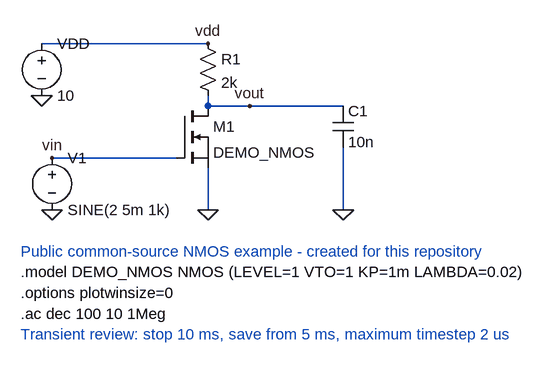
[diagram p0: schematic common_source_amplifier.asc]
common_source_amplifier.asc, the LTspice schematic file:
Version 4
SHEET 1 960 640
WIRE 336 32 80 32
WIRE 336 128 336 112
WIRE 400 128 336 128
WIRE 544 128 400 128
WIRE 288 208 96 208
WIRE 336 288 336 224
WIRE 544 288 544 192
FLAG 80 112 0
FLAG 96 288 0
FLAG 336 288 0
FLAG 544 288 0
FLAG 336 32 vdd
FLAG 96 208 vin
FLAG 400 128 vout
SYMBOL voltage 80 16 R0
SYMATTR InstName VDD
SYMATTR Value 10
SYMBOL res 320 16 R0
SYMATTR InstName R1
SYMATTR Value 2k
SYMBOL voltage 96 192 R0
SYMATTR InstName V1
SYMATTR Value SINE(2 5m 1k)
SYMATTR Value2 AC 1
SYMBOL nmos 288 128 R0
SYMATTR InstName M1
SYMATTR Value DEMO_NMOS
SYMATTR SpiceLine L=10u W=20u
SYMBOL cap 528 128 R0
SYMATTR InstName C1
SYMATTR Value 10n
TEXT 48 352 Left 2 ;Public common-source NMOS example - created for this repository
TEXT 48 384 Left 2 !.model DEMO_NMOS NMOS (LEVEL=1 VTO=1 KP=1m LAMBDA=0.02)
TEXT 48 416 Left 2 !.options plotwinsize=0
TEXT 48 448 Left 2 !.ac dec 100 10 1Meg
TEXT 48 480 Left 2 ;Transient review: stop 10 ms, save from 5 ms, maximum timestep 2 us

The netlist it stands for:
* common_source_amplifier.asc
VDD vdd 0 10
R1 vdd vout 2k
V1 vin 0 SINE(2 5m 1k) AC 1
M1 vout vin 0 0 DEMO_NMOS L=10u W=20u
C1 vout 0 10n
.model NMOS NMOS
.model PMOS PMOS
.lib standard.mos
* Public common-source NMOS example - created for this repository
.model DEMO_NMOS NMOS (LEVEL=1 VTO=1 KP=1m LAMBDA=0.02)
.options plotwinsize=0
.ac dec 100 10 1Meg
* Transient review: stop 10 ms, save from 5 ms, maximum timestep 2 us
.backanno
.end